# EAGLE design untitled (EAGLE 9.4.2)
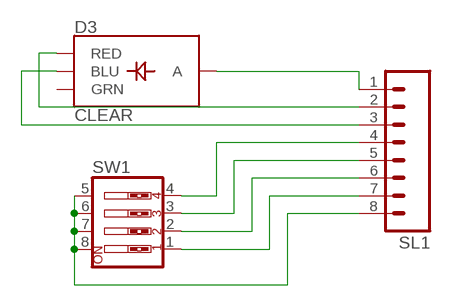
[diagram p0: schematic, sheet 1]

## Parts
D3  CLEAR  LED-RGB-CACLEAR  [LED-RGB-THRU]
SL1  M08  [08P]
SW1  SW_DIP-4  [EDG-04]

## Nets
N$1: D3.2(A) SL1.1
N$2: D3.1(RED) SL1.2
N$3: D3.4(BLU) SL1.3
N$4: SL1.4 SW1.4
N$5: SL1.5 SW1.3
N$6: SL1.6 SW1.2
N$7: SL1.7 SW1.1
N$8: SL1.8 SW1.5 SW1.6 SW1.7 SW1.8
Unconnected: D3.3(GRN)

## Library data of the parts
D3 = SparkFun-LEDmy:LED-RGB-CA: LED-RGB Diffused Common Anode Packages: LED RGB-THRU P-LCC-4-3 LED-TRICOLOR-SMD SparkFun Products: RGB Diffused Common Anode- Diffuse <[https://www.sparkfun.com/products/10821]> RGB Diffused Common Anode - Clear <[https://www.sparkfun.com/products/10820]> Qduino Mini <[https://www.sparkfun.com/products/13614]> Triple Output LED RGB - SMD <https://www.sparkfun.com/products/7844>; PROD_ID: DIO-10631
SL1 = con-amp-quick:M08: AMP QUICK CONNECTOR; OC_FARNELL: unknown; OC_NEWARK: unknown
SW1 = special:SW_DIP-4: DIP SWITCH

## Board
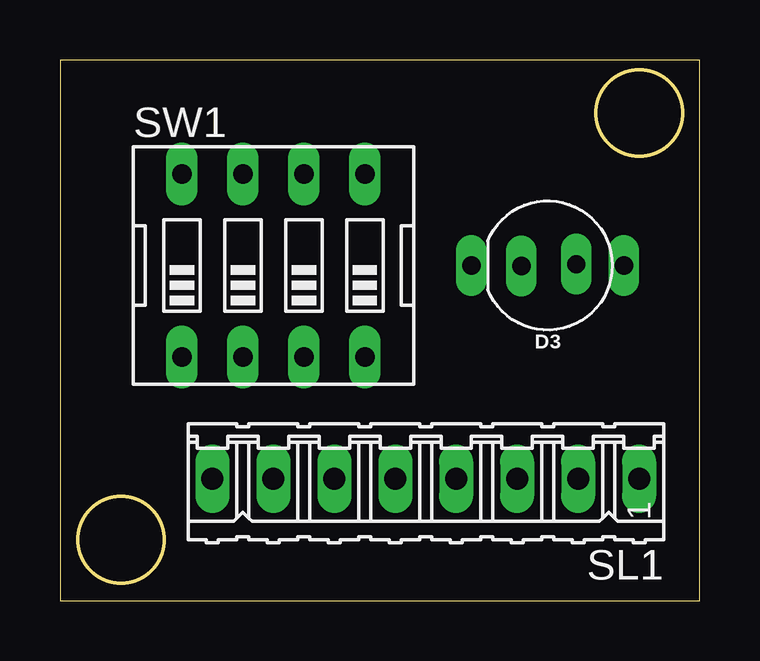
[diagram p1: board, top side]
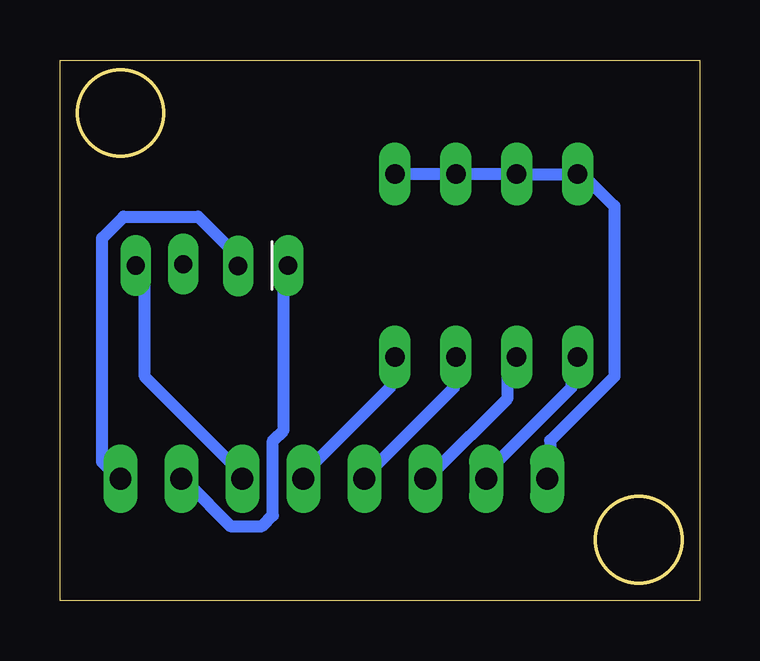
[diagram p2: board, bottom side, seen from below]

Size 26.65 x 22.53 mm. Coordinates in mm from the lower left corner, seen from the top.
Outline: 0,0 26.65,0 26.65,22.53 0,22.53 0,0
Copper layers (1*16): Top 0.035mm / dielectric 1.5mm / Bottom 0.035mm
Design rules "default *": minimum track width 20mil, minimum drill 0.35mm, track to track 15mil, track to pad 10mil, pad to pad 10mil, via to via 10mil, smd to smd 6mil, copper to edge 40mil, drill to drill 6mil, minimum pad ring 10mil, minimum via ring 8mil, stop-mask expansion 4mil, vias tented up to drill 0mil, thermal gap 10mil
Milling: area 0.7,0.7 to 4.3,4.3; area 22.3,18.5 to 25.9,22.1

### Footprints (pad centres in the part's own frame; a part is rotated, then mirrored left to right if it is on the bottom)
LED-RGB-THRU = drill 0.762 pad 0.889 long: 1 3.175,0; 2 1.092,0.025; 3 -1.194,-0.051; 4 -3.175,0
08P = drill 0.914 long: 1 -8.89,0; 2 -6.35,0; 3 -3.81,0; 4 -1.27,0; 5 1.27,0; 6 3.81,0; 7 6.35,0; 8 8.89,0
EDG-04 = drill 0.813 long: 1 -3.81,-3.81; 2 -1.27,-3.81; 3 1.27,-3.81; 4 3.81,-3.81; 5 3.81,3.81; 6 1.27,3.81; 7 -1.27,3.81; 8 -3.81,3.81

### Placement (x,y rotation side)
D3  20.32,13.97 180 top
SL1  15.24,5.08 180 top
SW1  8.89,13.97 0 top

### Tracks (layer width: path | path; a pad name or v marks a point on that pad's centre or on a via)
N$1
  Bottom 0.508: D3.2 19.56,14.22 19.56,14.67 20.89,16 24,16 24.89,15.11 24.89,5.78 24.45,5.33 SL1.1
N$2
  Bottom 0.508: D3.1 17.34,13.78 17.34,7.11 17.78,6.67 17.78,3.56 18.22,3.11 19.56,3.11 21.34,4.89 SL1.2
N$3
  Bottom 0.508: D3.4 23.11,13.78 23.11,9.34 19.11,5.33 SL1.3
N$4
  Bottom 0.508: SW1.4 12.89,9.78 12.89,8.89 16.45,5.33 SL1.4
N$5
  Bottom 0.508: SW1.3 10.22,9.78 10.22,8.89 13.78,5.33 SL1.5
N$6
  Bottom 0.508: SW1.2 8,9.78 8,8.45 11.11,5.33 SL1.6
N$7
  Bottom 0.508: SW1.1 5.33,9.78 5.33,8.89 8.89,5.33 SL1.7
N$8
  Bottom 0.508: SW1.5 SW1.6 SW1.7 SW1.8 4.89,17.78 3.56,16.45 3.56,9.34 6.22,6.67 6.22,5.33 SL1.8